# Altium project Tutorial Project.PrjPcb
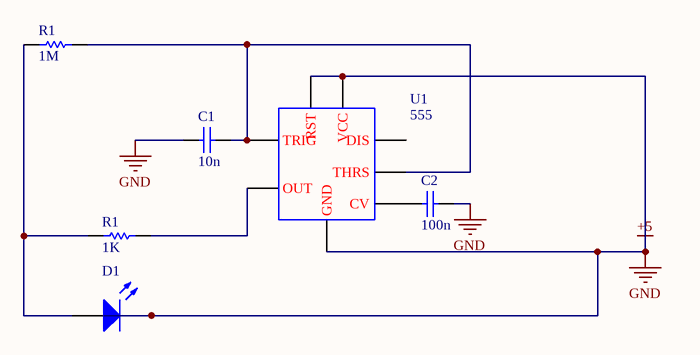
[diagram p0: Clocked LED 555.SchDoc]
1 sheet, 6 parts. Net scope: global (net labels, ports and power ports of the same name join across sheets).
Board file: Clocked LED 555.PcbDoc

## Sheet Clocked LED 555.SchDoc
size A; SheetNumber: 1; SheetTotal: 1

### Parts
(Parts that share a designator on the sheet are numbered #1, #2 ... from top to bottom, then left to right.)
C1  value 10n  (hidden comment: Capacitor)
C2  value 100n  (hidden comment: Capacitor)
D1  Light-Emitting Diode  (value not drawn)
R1#1  value 1M  (hidden comment: Resistor)
R1#2  value 1K  (hidden comment: Resistor)
U1  555

### Nets
+5: C1.2 C2.2 D1.2(K) U1.1(GND) U1.4(RST) U1.8(VCC)  [also labelled GND]
NetC1_1: C1.1 R1#1.2 U1.2(TRIG) U1.6(THRS)
NetC2_1: C2.1 U1.5(CV)
NetD1_1: D1.1(A) R1#1.1 R1#2.1
NetR1#2_2: R1#2.2 U1.3(OUT)

Not connected (* = marked no-connect by the designer): U1 7(DIS)

### Library data of the parts
C1 C2 = Capacitor: SimulationGenericComponent: True
D1 = LED: AF: 1; BV: 0; BV_MAX: 1e99; EG: 1.11; FC: 0.5; IBV: 0.001; IS: 1e-14; MJSW: 0.33; NTUN: 30; TNOM: 27; XTI: 3; SimulationGenericComponent: True; CJO: 0; CJP: 0; CTA: 0; CTP: 0; FCS: 0.5; FV_MAX: 1e99; IKF: 0; IKR: 0; ISR: 1e-14; JSW: 0; JTUN: 0; JTUNSW: 0; KEG: 1; KF: 0; LEVEL: 1; N: 1; NBV: 1; NR: 1; NS: 1; PHP: 1; RS: 0; TCV: 0; TLEV: 0; TLEVC: 0; TM1: 0; TM2: 0; TPB: 0; TPHP: 0; TRS: 0; TRS2: 0; TT: 0; TTT1: 0; TTT2: 0; VJ: 1; XTITUN: 3
R1#1 R1#2 = Resistor: TC1: 0; SimulationGenericComponent: True; TC2: 0
U1 = 555: Timer 555; SimulationGenericComponent: True